# EAGLE design controller_v3 (EAGLE 7.1.0)

## Sheet 1 of 4
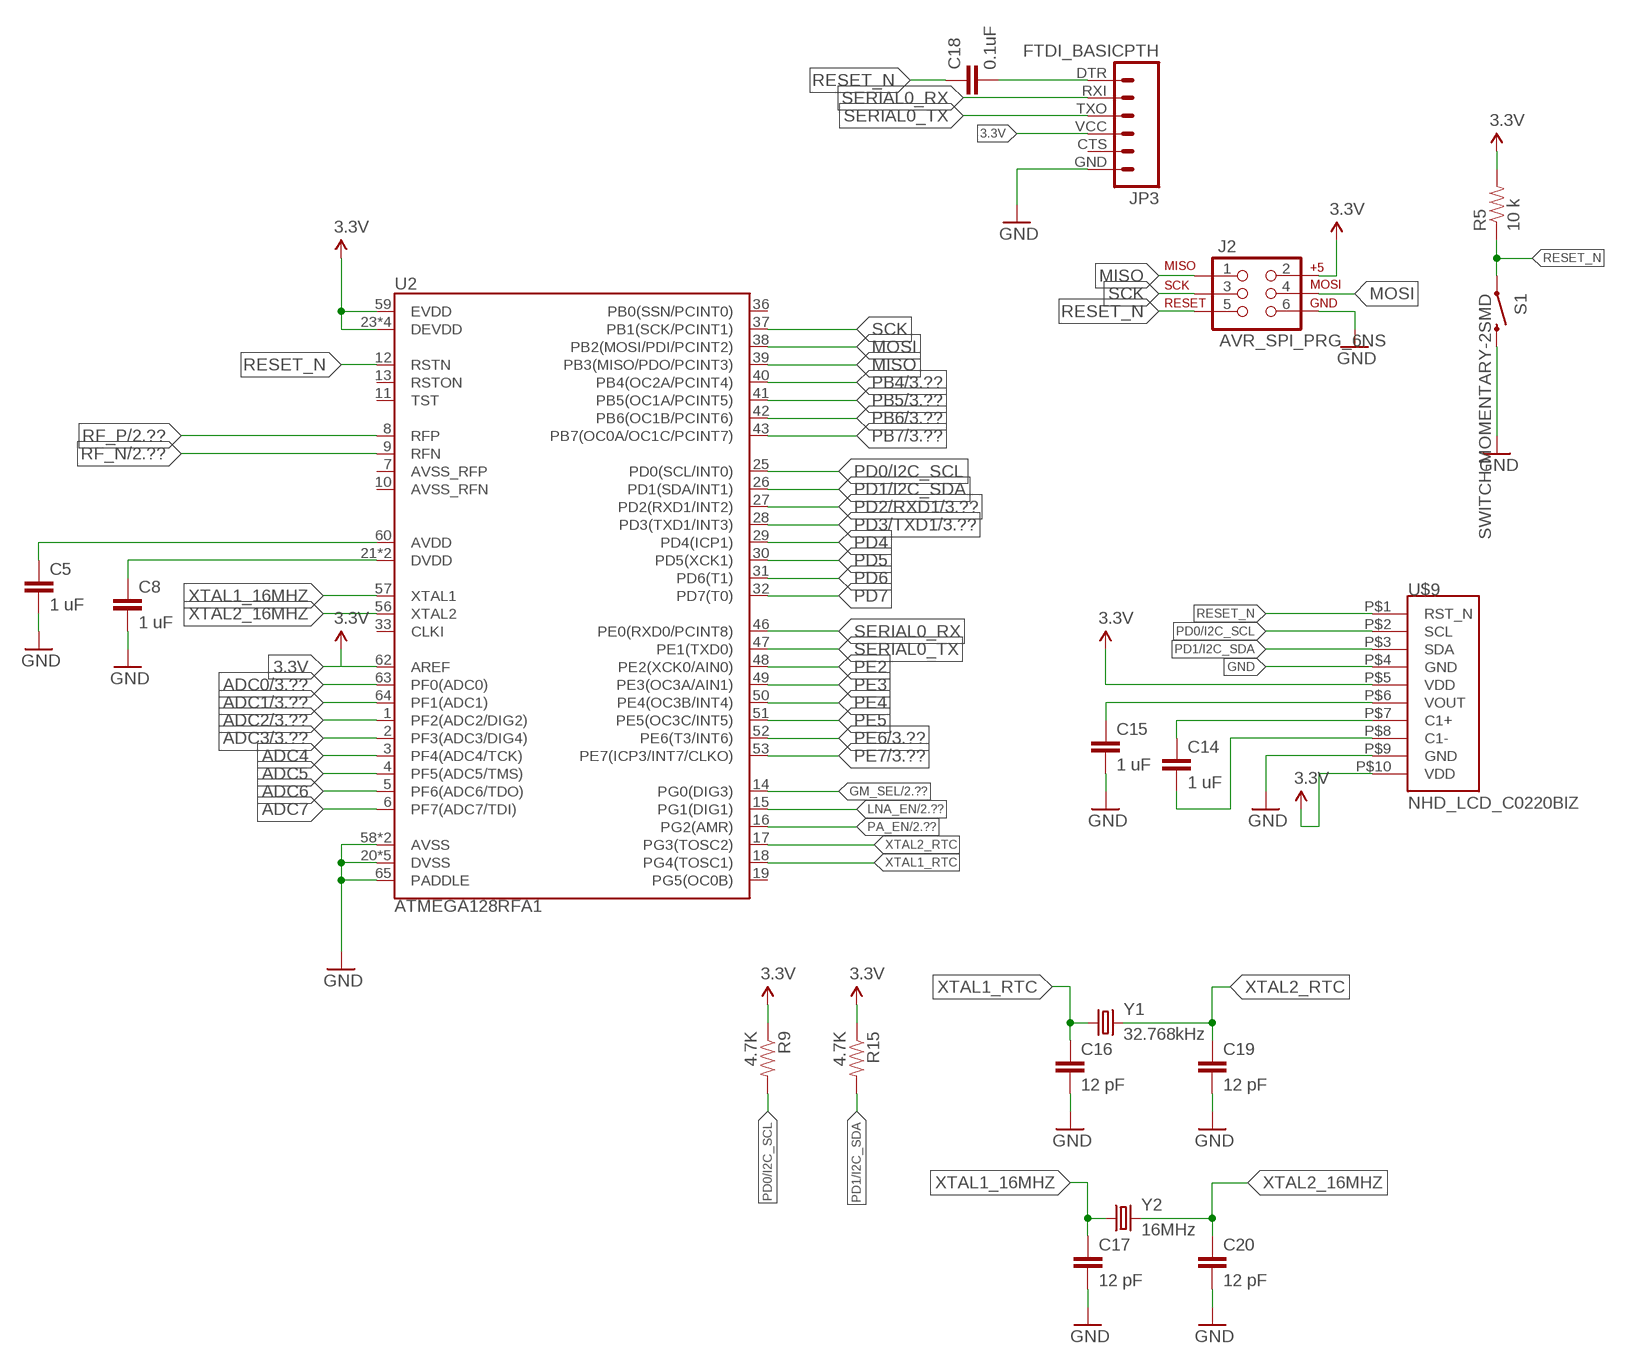
[diagram p0: schematic, sheet 1]

### Parts
C5  1 uF  CAP0805  [0805]
C8  1 uF  CAP0805  [0805]
C14  1 uF  CAP0805  [0805]
C15  1 uF  CAP0805  [0805]
C16  12 pF  CAP0805  [0805]
C17  12 pF  CAP0805  [0805]
C18  0.1uF  CAP0805  [0805]
C19  12 pF  CAP0805  [0805]
C20  12 pF  CAP0805  [0805]
J2  AVR_SPI_PRG_6NS  [2X3-NS]
JP3  FTDI_BASICPTH  [FTDI_BASIC]
R5  10 k  RESISTOR0805-RES  [0805]
R9  4.7K  RESISTOR0805-RES  [0805]
R15  4.7K  RESISTOR0805-RES  [0805]
S1  SWITCH-MOMENTARY-2SMD  [TACTILE_SWITCH_SMD]
U2  ATMEGA128RFA1  [QFN-64]
U$9  NHD_LCD_C0220BIZ  [1X08-2MMPTH-LCD]
Y1  32.768kHz  CRYSTAL32-SMD  [CRYSTAL-32KHZ-SMD]
Y2  16MHz  CRYSTAL5X3  [CRYSTAL-SMD-5X3]

### Nets
3.3V: J2.2 JP3.VCC R5.2 R9.1 R15.1 U2.23(DEVDD) U2.34(DEVDD) U2.44(DEVDD) U2.54(DEVDD) U2.59(EVDD) U2.62(AREF) U$9.P$5(VDD) U$9.P$10(VDD) ; also sheet 2,3,4
ADC0: U2.63(PF0(ADC0)) ; also sheet 3
ADC1: U2.64(PF1(ADC1)) ; also sheet 3
ADC2: U2.1(PF2(ADC2/DIG2)) ; also sheet 3
ADC3: U2.2(PF3(ADC3/DIG4)) ; also sheet 3
ADC4: U2.3(PF4(ADC4/TCK))
ADC5: U2.4(PF5(ADC5/TMS))
ADC6: U2.5(PF6(ADC6/TDO))
ADC7: U2.6(PF7(ADC7/TDI))
GM_SEL: U2.14(PG0(DIG3)) ; also sheet 2
GND: C5.2 C8.2 C15.2 C16.2 C17.2 C19.2 C20.2 J2.6 JP3.GND S1.3 U2.20(DVSS) U2.24(DVSS) U2.35(DVSS) U2.45(DVSS) U2.55(DVSS) U2.58(AVSS) U2.61(AVSS) U2.65(PADDLE) U$9.P$4(GND) U$9.P$9(GND) ; also sheet 2,3,4
LNA_EN: U2.15(PG1(DIG1)) ; also sheet 2
MISO: J2.1 U2.39(PB3(MISO/PDO/PCINT3))
MOSI: J2.4 U2.38(PB2(MOSI/PDI/PCINT2))
N$2: C18.2 JP3.DTR
N$5: C14.1 U$9.P$7(C1+)
N$15: C5.1 U2.60(AVDD)
N$16: C8.1 U2.21(DVDD) U2.22(DVDD)
N$22: C14.2 U$9.P$8(C1-)
PA_EN: U2.16(PG2(AMR)) ; also sheet 2
PB4: U2.40(PB4(OC2A/PCINT4)) ; also sheet 3
PB5: U2.41(PB5(OC1A/PCINT5)) ; also sheet 3
PB6: U2.42(PB6(OC1B/PCINT6)) ; also sheet 3
PB7: U2.43(PB7(OC0A/OC1C/PCINT7)) ; also sheet 3
PD0/I2C_SCL: R9.2 U2.25(PD0(SCL/INT0)) U$9.P$2(SCL)
PD1/I2C_SDA: R15.2 U2.26(PD1(SDA/INT1)) U$9.P$3(SDA)
PD2/RXD1: U2.27(PD2(RXD1/INT2)) ; also sheet 3
PD3/TXD1: U2.28(PD3(TXD1/INT3)) ; also sheet 3
PD4: U2.29(PD4(ICP1))
PD5: U2.30(PD5(XCK1))
PD6: U2.31(PD6(T1))
PD7: U2.32(PD7(T0))
PE2: U2.48(PE2(XCK0/AIN0))
PE3: U2.49(PE3(OC3A/AIN1))
PE4: U2.50(PE4(OC3B/INT4))
PE5: U2.51(PE5(OC3C/INT5))
PE6: U2.52(PE6(T3/INT6)) ; also sheet 3
PE7: U2.53(PE7(ICP3/INT7/CLKO)) ; also sheet 3
RESET_N: C18.1 J2.5 R5.1 S1.1 U2.12(RSTN) U$9.P$1(RST_N)
RF_N: U2.9(RFN) ; also sheet 2
RF_P: U2.8(RFP) ; also sheet 2
SCK: J2.3 U2.37(PB1(SCK/PCINT1))
SERIAL0_RX: JP3.RXI U2.46(PE0(RXD0/PCINT8))
SERIAL0_TX: JP3.TXO U2.47(PE1(TXD0))
VOUT: C15.1 U$9.P$6(VOUT)
XTAL1_16MHZ: C17.1 U2.57(XTAL1) Y2.1
XTAL1_RTC: C16.1 U2.18(PG4(TOSC1)) Y1.X1
XTAL2_16MHZ: C20.1 U2.56(XTAL2) Y2.3
XTAL2_RTC: C19.1 U2.17(PG3(TOSC2)) Y1.X2
Unconnected: JP3.CTS U2.7(AVSS_RFP) U2.10(AVSS_RFN) U2.11(TST) U2.13(RSTON) U2.19(PG5(OC0B)) U2.33(CLKI) U2.36(PB0(SSN/PCINT0))

## Sheet 2 of 4
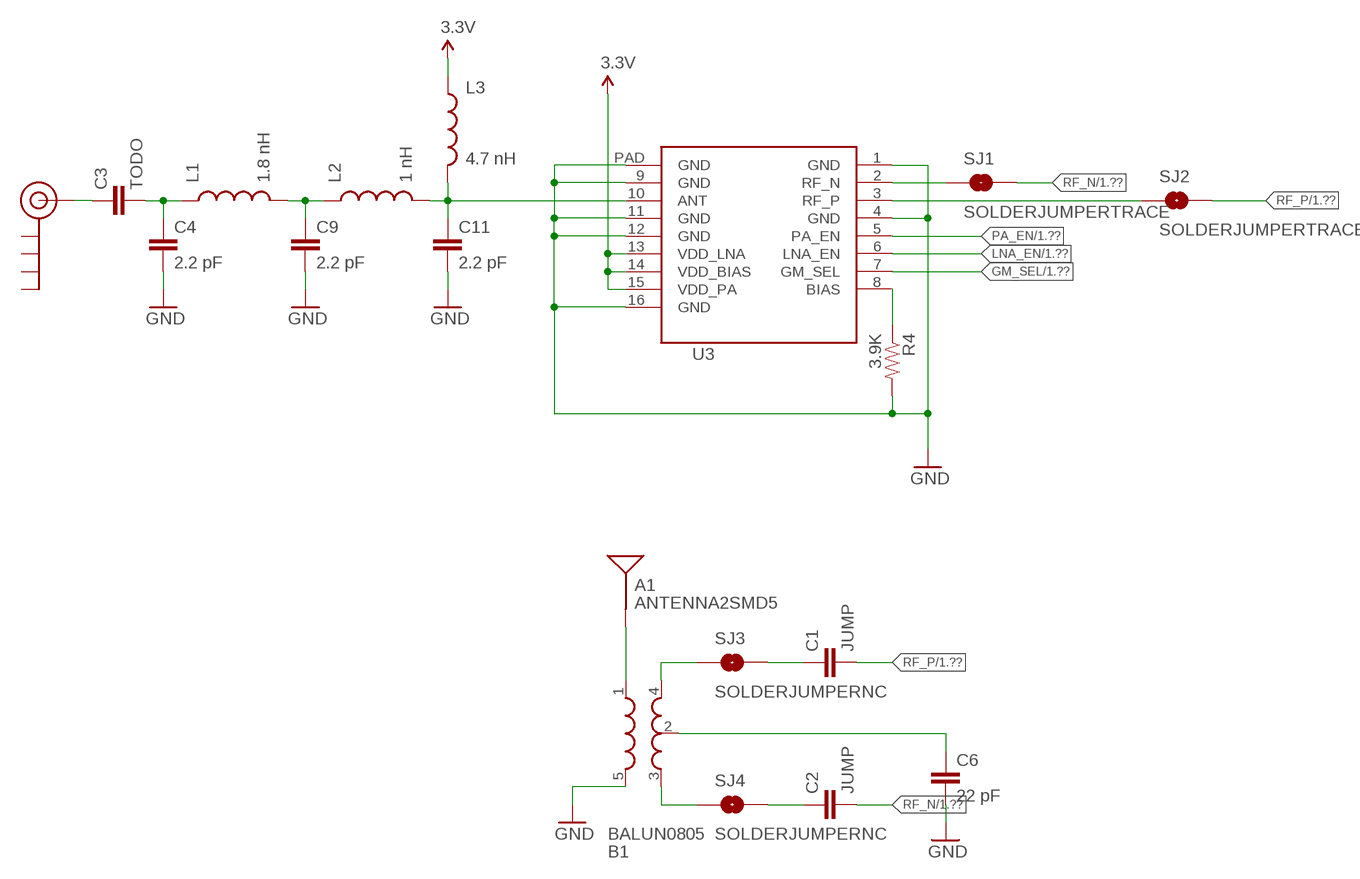
[diagram p1: schematic, sheet 2]

### Parts
A1  ANTENNA2SMD5  [ANTENNA-CHIP5]
B1  BALUN0805  [BALUN]
C1  JUMP  CAP0805  [0805]
C2  JUMP  CAP0805  [0805]
C3  TODO  CAP0805  [0805]
C4  2.2 pF  CAP0805  [0805]
C6  22 pF  CAP0805  [0805]
C9  2.2 pF  CAP0805  [0805]
C11  2.2 pF  CAP0805  [0805]
J$1  SMA_EDGE  [SMA-EDGE]
L1  1.8 nH  INDUCTOR0805  [0805]
L2  1 nH  INDUCTOR0805  [0805]
L3  4.7 nH  INDUCTOR0805  [0805]
R4  3.9K  RESISTOR0805-RES  [0805]
SJ1  SOLDERJUMPERTRACE  [SJ_2S-TRACE]
SJ2  SOLDERJUMPERTRACE  [SJ_2S-TRACE]
SJ3  SOLDERJUMPERNC  [SJ_2S]
SJ4  SOLDERJUMPERNC  [SJ_2S]
U3  RF_AMPLIFIER  CC2592QF  [QFN65P400X400X100-17N]

### Nets
3.3V: L3.1 U3.13(VDD_LNA) U3.14(VDD_BIAS) U3.15(VDD_PA) ; also sheet 1,3,4
GM_SEL: U3.7(GM_SEL) ; also sheet 1
GND: B1.5(GND) C4.2 C6.2 C9.2 C11.2 R4.2 U3.1(GND) U3.4(GND) U3.9(GND) U3.11(GND) U3.12(GND) U3.16(GND) U3.PAD(GND) ; also sheet 1,3,4
LNA_EN: U3.6(LNA_EN) ; also sheet 1
N$1: C9.1 L1.2 L2.1
N$3: C11.1 L2.2 L3.2 U3.10(ANT)
N$4: C3.2 C4.1 L1.1
N$6: SJ1.1 U3.2(RF_N)
N$7: R4.1 U3.8(BIAS)
N$8: C3.1 J$1.SIG(SIGNAL)
N$9: B1.4(OUT1) SJ3.1
N$10: B1.3(OUT2) SJ4.1
N$11: B1.2(GND) C6.1
N$12: A1.FEED(SIGNAL) B1.1(IN)
N$13: C2.1 SJ4.2
N$14: C1.1 SJ3.2
N$17: SJ2.1 U3.3(RF_P)
PA_EN: U3.5(PA_EN) ; also sheet 1
RF_N: C2.2 SJ1.2 ; also sheet 1
RF_P: C1.2 SJ2.2 ; also sheet 1
Unconnected: J$1.GND@0(GND) J$1.GND@1(GND) J$1.GND@2(GND) J$1.GND@3(GND)

## Sheet 3 of 4
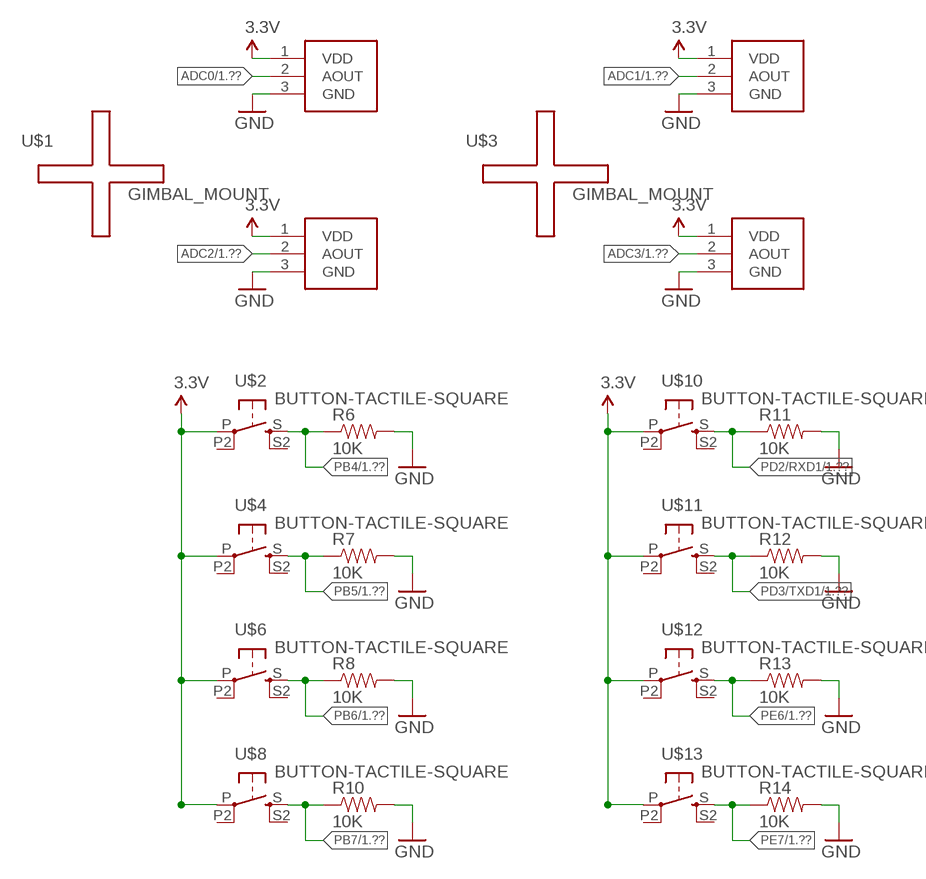
[diagram p2: schematic, sheet 3]

### Parts
J3  GIMBAL_3PIN  [JST-3-PTH]
J4  GIMBAL_3PIN  [JST-3-PTH]
J5  GIMBAL_3PIN  [JST-3-PTH]
J6  GIMBAL_3PIN  [JST-3-PTH]
R6  10K  RESISTOR0805-RES  [0805]
R7  10K  RESISTOR0805-RES  [0805]
R8  10K  RESISTOR0805-RES  [0805]
R10  10K  RESISTOR0805-RES  [0805]
R11  10K  RESISTOR0805-RES  [0805]
R12  10K  RESISTOR0805-RES  [0805]
R13  10K  RESISTOR0805-RES  [0805]
R14  10K  RESISTOR0805-RES  [0805]
U$1  GIMBAL_MOUNT  [GIMBAL_FOOTPRINT]
U$2  BUTTON-TACTILE-SQUARE  [BUTTON-TACTILE-SQUARE-ADAFRUIT1010]
U$3  GIMBAL_MOUNT  [GIMBAL_FOOTPRINT]
U$4  BUTTON-TACTILE-SQUARE  [BUTTON-TACTILE-SQUARE-ADAFRUIT1010]
U$6  BUTTON-TACTILE-SQUARE  [BUTTON-TACTILE-SQUARE-ADAFRUIT1010]
U$8  BUTTON-TACTILE-SQUARE  [BUTTON-TACTILE-SQUARE-ADAFRUIT1010]
U$10  BUTTON-TACTILE-SQUARE  [BUTTON-TACTILE-SQUARE-ADAFRUIT1010]
U$11  BUTTON-TACTILE-SQUARE  [BUTTON-TACTILE-SQUARE-ADAFRUIT1010]
U$12  BUTTON-TACTILE-SQUARE  [BUTTON-TACTILE-SQUARE-ADAFRUIT1010]
U$13  BUTTON-TACTILE-SQUARE  [BUTTON-TACTILE-SQUARE-ADAFRUIT1010]

### Nets
3.3V: J3.1(VDD) J4.1(VDD) J5.1(VDD) J6.1(VDD) U$2.P U$4.P U$6.P U$8.P U$10.P U$11.P U$12.P U$13.P ; also sheet 1,2,4
ADC0: J6.2(AOUT) ; also sheet 1
ADC1: J3.2(AOUT) ; also sheet 1
ADC2: J5.2(AOUT) ; also sheet 1
ADC3: J4.2(AOUT) ; also sheet 1
GND: J3.3(GND) J4.3(GND) J5.3(GND) J6.3(GND) R6.2 R7.2 R8.2 R10.2 R11.2 R12.2 R13.2 R14.2 ; also sheet 1,2,4
PB4: R6.1 U$2.S ; also sheet 1
PB5: R7.1 U$4.S ; also sheet 1
PB6: R8.1 U$6.S ; also sheet 1
PB7: R10.1 U$8.S ; also sheet 1
PD2/RXD1: R11.1 U$10.S ; also sheet 1
PD3/TXD1: R12.1 U$11.S ; also sheet 1
PE6: R13.1 U$12.S ; also sheet 1
PE7: R14.1 U$13.S ; also sheet 1
Unconnected: U$2.P2(P1) U$2.S2(S1) U$4.P2(P1) U$4.S2(S1) U$6.P2(P1) U$6.S2(S1) U$8.P2(P1) U$8.S2(S1) U$10.P2(P1) U$10.S2(S1) U$11.P2(P1) U$11.S2(S1) U$12.P2(P1) U$12.S2(S1) U$13.P2(P1) U$13.S2(S1)

## Sheet 4 of 4
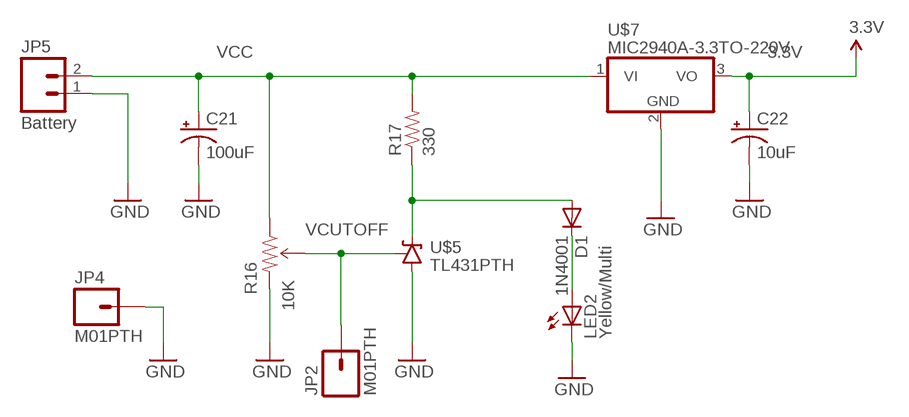
[diagram p3: schematic, sheet 4]

### Parts
C21  100uF  CPOL-USE3.5-8  [E3,5-8]
C22  10uF  CPOL-USE2.5-5  [E2,5-5]
D1  1N4001  1N4004  [DO41-10]
JP2  M01PTH  [1X01]
JP4  M01PTH  [1X01]
JP5  Battery  M02PTH  [1X02]
LED2  Yellow/Multi  LED5MM  [LED5MM]
R16  10K  TRIMPOT-PTH-KNOB  [3386U]
R17  330  RESISTORAXIAL-0.3  [AXIAL-0.3]
U$5  TL431PTH  [TO-92]
U$7  MIC2940A-3.3TO-220V  [TO-220V]

### Nets
3.3V: C22.+ U$7.3(VO) ; also sheet 1,2,3
GND: C21.- C22.- JP4.1 JP5.1 LED2.K(C) R16.3(CW) U$5.2(A) U$7.2(GND) ; also sheet 1,2,3
N$20: D1.A R17.P$1 U$5.3(C)
N$21: D1.C LED2.A
VCC: C21.+ JP5.2 R16.1(CCW) R17.P$2 U$7.1(VI)
VCUTOFF: JP2.1 R16.2(WIPER) U$5.1(R)

## Library data of the parts
A1 = Controller:ANTENNA2: Chip antenna Single endded antenna. Common with smaller chip antennas. CHIP4 package is the GPS Chip Antenna SKU: GPS-08418. CHIP5 package is 2.4GHz chip antenna SKU: WRL-00144.
B1 = Controller:BALUN: 0805 footprint balun- Ember 351/357
C1-C6 C8 C9 C11 C14-C20 = Controller:CAP: Capacitor Standard 0603 ceramic capacitor, and 0.1" leaded capacitor.
C21 C22 = rcl:CPOL-US: POLARIZED CAPACITOR, American symbol
D1 = diode:1N4004: DIODE general purpose rectifier, 1 A
J2 = Controller:AVR_SPI_PRG_6: AVR ISP 6 Pin This is the reduced ISP connector for AVR programming. Common on Arduino. This footprint will take up less PCB space and can be used with a 10-pin to 6-pin adapter such as SKU: BOB-08508
J3-J6 = Controller:GIMBAL_3PIN: This is the surface mount connector for the 9XR Replacement Gimbal. It uses a 3 Pin, 2 mm Pitch, JST connector (https://www.sparkfun.com/products/9750) You can see the analog transmitter here: http://www.hobbyking.com/hobbyking/store/__39505__Transmitter_Gimbal_Set_Left_Turnigy_9XR_Transmitter_Mode_1.html The black wire is VDD, the White wire is Ground, the Red wire is Analog Out Author: Dustin Richmond Created: 10/25/2014
J$1 = Controller:SMA_EDGE: SMA Antenna Connector End launch SMA connector. The paste layer has been removed so that the connector can be hand soldered onto the board after reflow.
JP2 JP4 = SparkFun:M01: Header 1 Standard 1-pin 0.1" header. Use with straight break away headers (SKU : PRT-00116), right angle break away headers (PRT-00553), swiss pins (PRT-00743), machine pins (PRT-00117), and female headers (PRT-00115).
JP3 = Controller:FTDI_BASIC: FTDI Basic header with labels
JP5 = SparkFun:M02: Header 2 Standard 2-pin 0.1" header. Use with straight break away headers (SKU : PRT-00116), right angle break away headers (PRT-00553), swiss pins (PRT-00743), machine pins (PRT-00117), and female headers (PRT-00115). Molex polarized connector foot print use with SKU : PRT-08233 with associated crimp pins and housings.
L1-L3 = Controller:INDUCTOR: Inductors Basic Inductor/Choke - 0603 and 1206. Footprints are not proven and vary greatly between part numbers. SRN6045- 33uH, 20% 1.4A SDR0403-560KL - 56uH, 10%, 500mA RMS/740mA peak
LED2 = SparkFun:LED: LEDs Standard schematic elements and footprints for 5mm, 3mm, 1206, and 0603 sized LEDs. 5mm - Spark Fun Electronics SKU : COM-00529 (and others)
R4-R15 = Controller:RESISTOR: Resistor Basic schematic elements and footprints for 0603, 1206, and PTH resistors.
R16 = SparkFun:TRIMPOT
R17 = SparkFun:RESISTOR: Resistor Basic schematic elements and footprints for 0603, 1206, and PTH resistors.
S1 = Controller:SWITCH-MOMENTARY-2: Various NO switches- pushbuttons, reed, etc
SJ1-SJ4 = Controller:SOLDERJUMPER: Solder Jumper Standard SMD solder jumper. Used to automate production. Two varients : Normally Open and Normally Closed are the same, but have different paste layers. NC will have a large amount of paste and should jumper during reflow.
U2 = Controller:ATMEGA128RFA1: ATmega128RFA1 8-bit AVR Microcontroller with Low Power 2.4GHz Transceiver for ZigBee and IEEE 802.15.4
U3 = Controller:CC2592: Device Symbol for the CC2592 QFN16 RF Amplifier Chip from Texas Instruments. Description: The CC2592 device is a cost-effective and high-performance RF front end for low-power and low-voltage 2.4-GHz wireless applications.The CC2592 device is a range extender for all CC25XX 2.4-GHz low-power RF transceivers, transmitters, and system-on-chip products from Texas Instruments.To increase the link budget, the CC2592 device provides a power amplifier for increased output power and an LNA with a low-noise figure for improved receiver sensitivity.The CC2592 device provides a very small size, high-output power RF design with its 4-mm × 4-mm QFN-16 package.The CC2592 device contains PA, LNA, switches, RF-matching, and balun for simple design of high-performance wireless applications Datasheet: http://www.ti.com/general/docs/lit/getliterature.tsp?genericPartNumber=cc2592&fileType=pdf Note: I have NOT added the thermal pads expected in the datasheet. These should be added by the end user on their PCB Author: Dustin Richmond Date Created: 10/16/2014 Reviewer 1: Reviewer 2:
U$1 U$3 = Controller:GIMBAL_MOUNT
U$2 U$4 U$6 U$8 U$10-U$13 = Controller:BUTTON-TACTILE
U$5 = SparkFun:TL431
U$7 = SparkFun:MIC2940A-3.3: MIC2940A-3.3 Voltage Regulator 3.3V mic2940.pdf
U$9 = Controller:NHD_LCD_C0220BIZ: This is the device for the NHD‐C0220BiZ‐FSW‐FBW‐3V3M COG (Chip‐On‐Glass) Character Liquid Crystal Display Module. Datasheet: http://www.newhavendisplay.com/specs/NHD-C0220BiZ-FSW-FBW-3V3M.pdf Author: Dustin Richmond Created: 10/25/2014
Y1 Y2 = Controller:CRYSTAL: Various standard crystals. Proven footprints. Spark Fun Electronics SKU : COM-00534

## Board
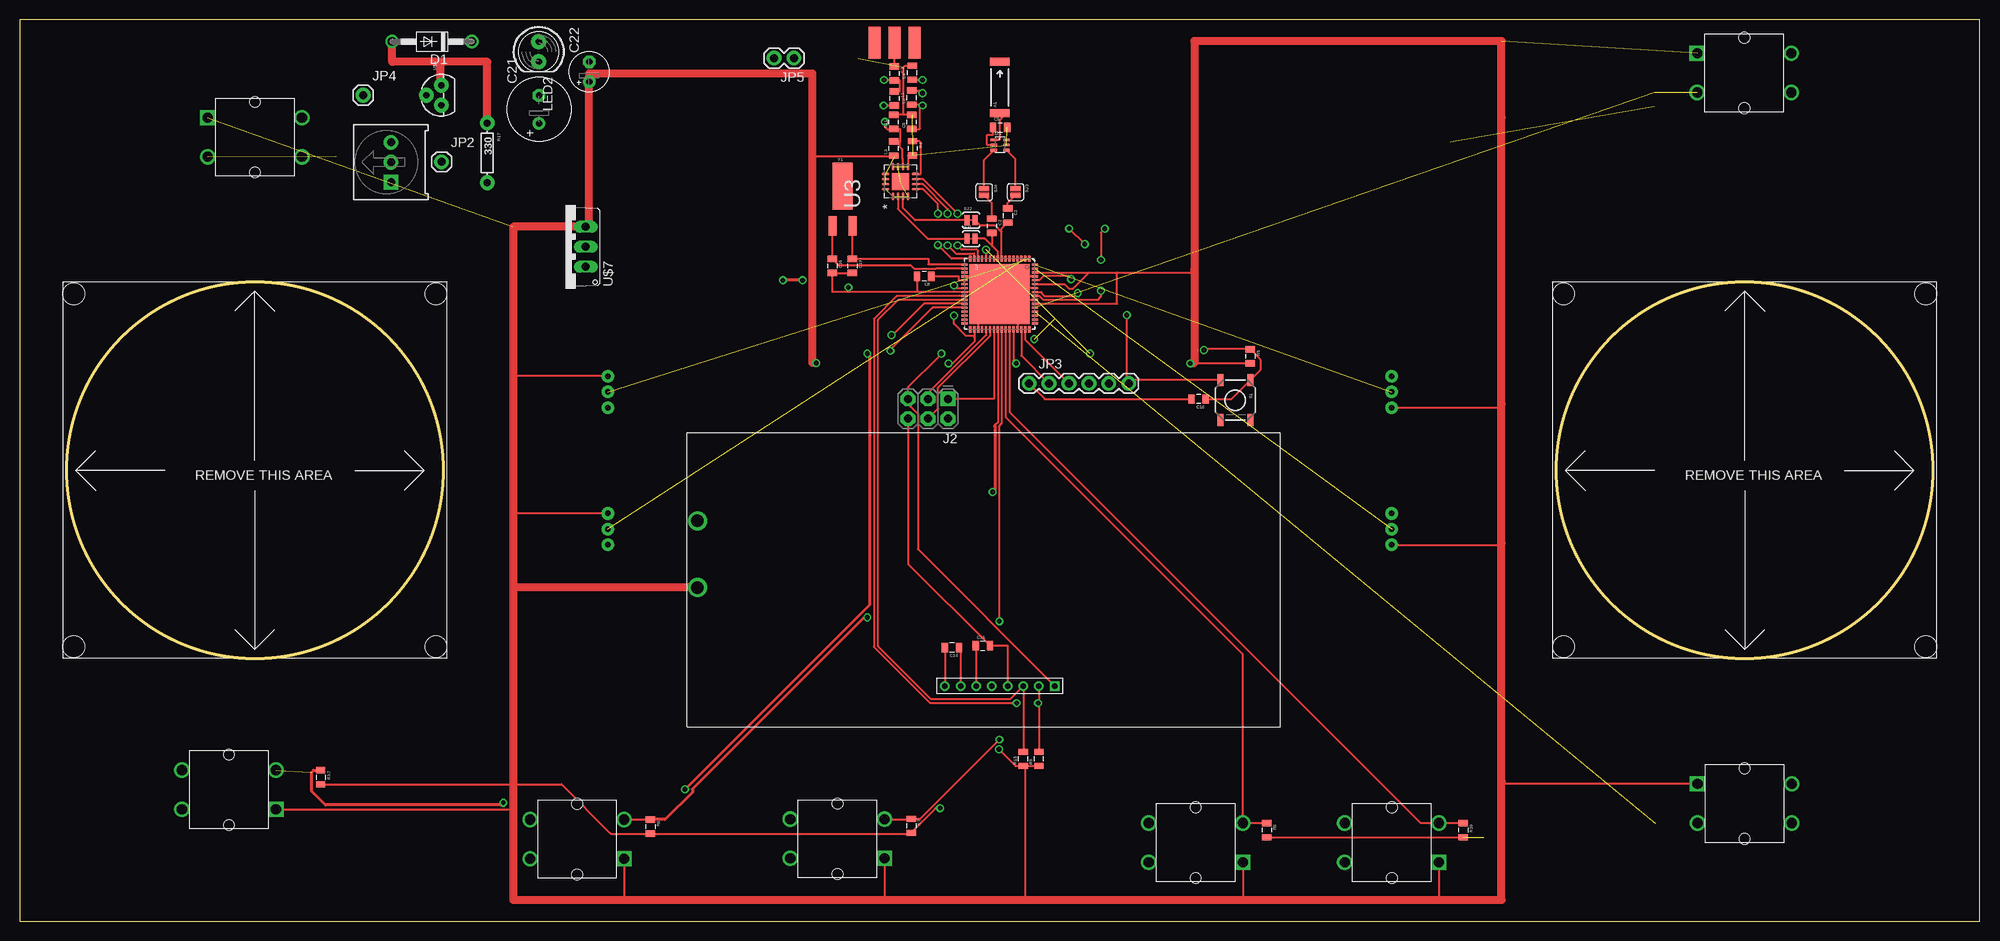
[diagram p4: board, top side]
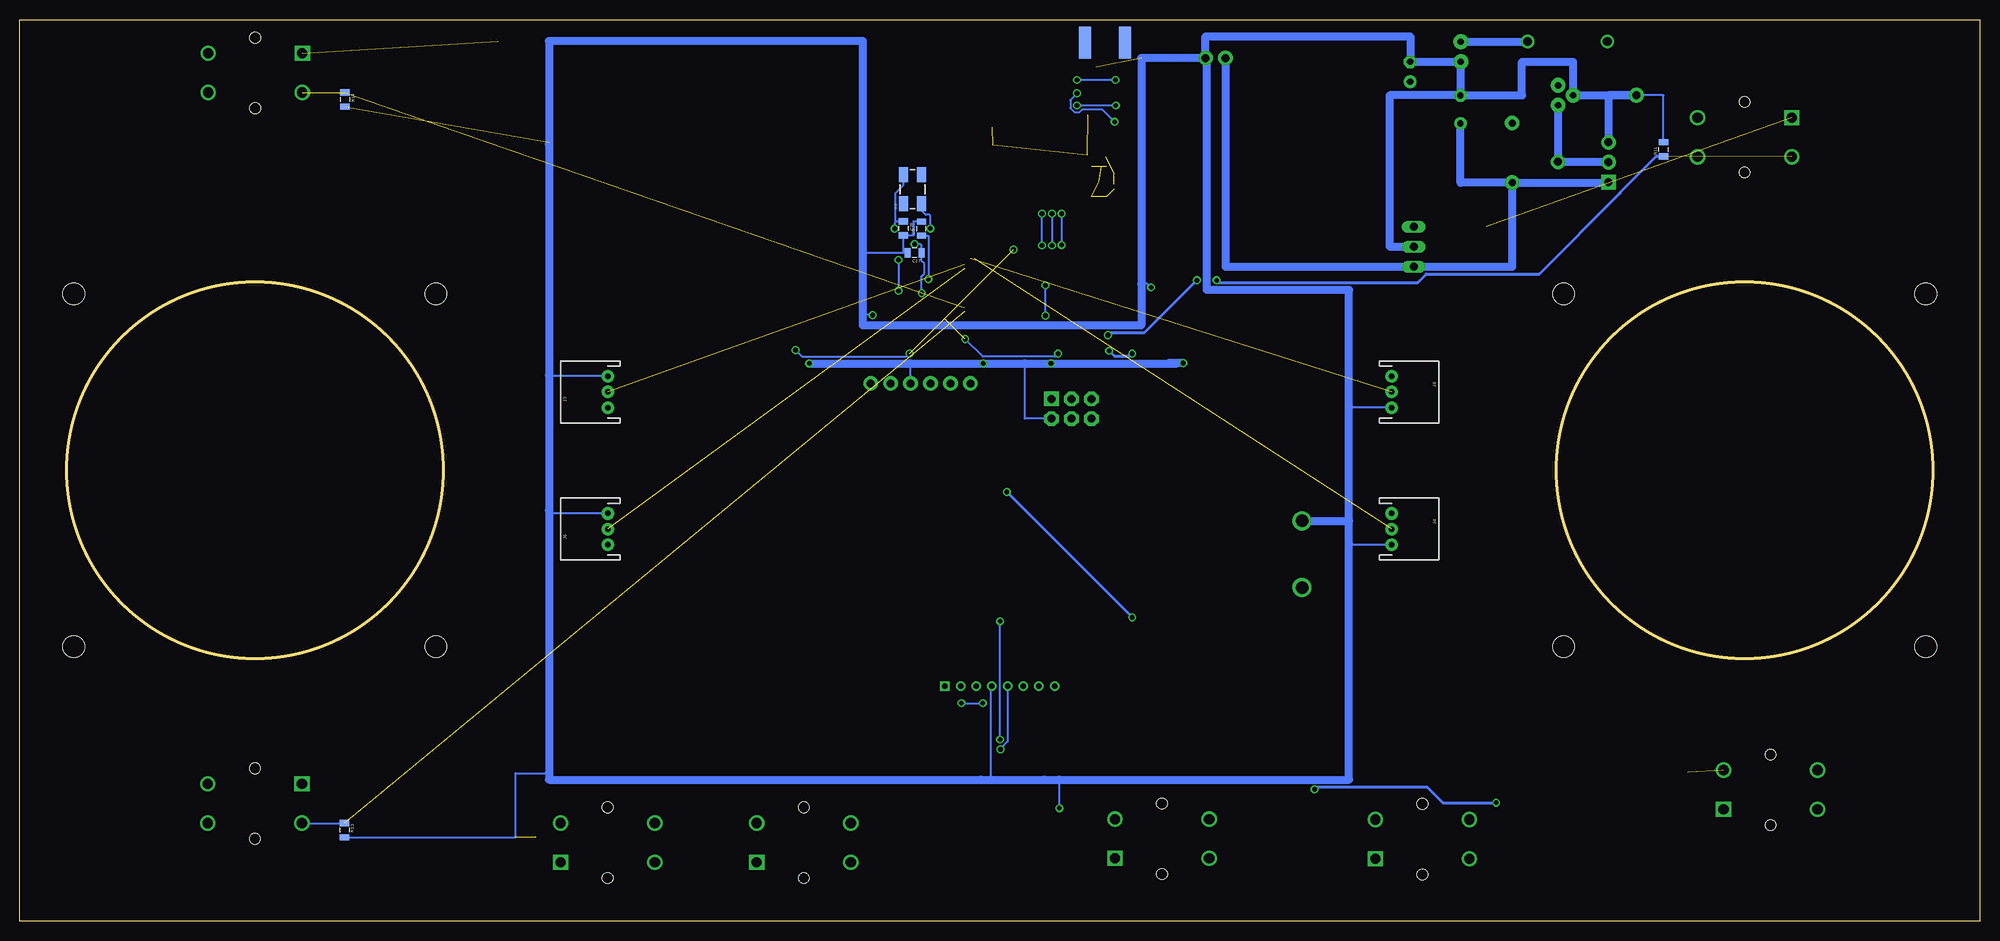
[diagram p5: board, bottom side, seen from below]

Size 250 x 115 mm. Coordinates in mm from the lower left corner, seen from the top.
Outline: 0,0 250,0 250,115 0,115 0,0
Copper layers (1*16): Top 0.035mm / dielectric 1.5mm / Bottom 0.035mm
Design rules "default": minimum track width 10mil, minimum drill 24mil, track to track 8mil, track to pad 8mil, pad to pad 8mil, via to via 8mil, smd to smd 8mil, copper to edge 40mil, drill to drill 8mil, minimum pad ring 10mil, minimum via ring 8mil, stop-mask expansion 4mil, vias tented up to drill 0mil, thermal gap 10mil

### Footprints (pad centres in the part's own frame; a part is rotated, then mirrored left to right if it is on the bottom)
ANTENNA-CHIP5 = smd 1.016 x 2.54: FEED -3.302,0; NC 3.302,0
BALUN = smd 0.35 x 0.8: 1 -0.65,-0.8; 2 0,-0.8; 3 0.65,-0.8; 4 0.65,0.8; 5 0,0.8; 6 -0.65,0.8
0805 = smd 0.8 x 1.2: 1 -0.9,0; 2 0.9,0
E3,5-8 = drill 0.813 pad 1.6: + -1.778,0 | drill 0.813 pad 1.6 octagon: - 1.778,0
E2,5-5 = drill 0.813 pad 1.6: + -1.27,0 | drill 0.813 pad 1.6 octagon: - 1.27,0
DO41-10 = drill 1.118: A 5.08,0; C -5.08,0
2X3-NS = drill 1.016 pad 1.88 square: 1 -2.54,-1.27 | drill 1.016 pad 1.88 octagon: 2 -2.54,1.27; 3 0,-1.27; 4 0,1.27; 5 2.54,-1.27; 6 2.54,1.27
JST-3-PTH = drill 0.7 pad 1.6: 1 -2,0; 2 0,0; 3 2,0
SMA-EDGE = smd 1.524 x 4.064: GND@0 0,0; GND@1 5.08,0; SIG 2.54,0 | smd 1.524 x 4.064 bottom: GND@2 0,0; GND@3 5.08,0
1X01 = drill 1.016 pad 1.88: 1 0,0
FTDI_BASIC = drill 1.016 pad 1.88: CTS 10.16,0; DTR 0,0; GND 12.7,0; RXI 2.54,0; TXO 5.08,0; VCC 7.62,0
1X02 = drill 1.016 pad 1.88: 1 0,0; 2 2.54,0
LED5MM = drill 0.813 pad 1.88: A -1.27,0; K 1.27,0
3386U = drill 1.016 pad 1.88 square: 1 -2.54,-0.015 | drill 1.016 pad 1.88: 2 0,-0.015; 3 2.54,-0.015
AXIAL-0.3 = drill 0.9 pad 1.88: P$1 -3.81,0; P$2 3.81,0
TACTILE_SWITCH_SMD = smd 1.524 x 0.762: 1 -2.54,1.905; 2 2.54,1.905; 3 -2.54,-1.905; 4 2.54,-1.905
SJ_2S-TRACE = smd 0.635 x 1.27: 1 -0.508,0; 2 0.508,0
SJ_2S = smd 0.635 x 1.27: 1 -0.412,0; 2 0.412,0
QFN-64 = smd 0.8 x 0.28: 1 -4.5,3.75; 2 -4.5,3.25; 3 -4.5,2.75; 4 -4.5,2.25; 5 -4.5,1.75; 6 -4.5,1.25; 7 -4.5,0.75; 8 -4.5,0.25; 9 -4.5,-0.25; 10 -4.5,-0.75; 11 -4.5,-1.25; 12 -4.5,-1.75; 13 -4.5,-2.25; 14 -4.5,-2.75; 15 -4.5,-3.25; 16 -4.5,-3.75; 33 4.5,-3.75; 34 4.5,-3.25; 35 4.5,-2.75; 36 4.5,-2.25; 37 4.5,-1.75; 38 4.5,-1.25; 39 4.5,-0.75; 40 4.5,-0.25; 41 4.5,0.25; 42 4.5,0.75; 43 4.5,1.25; 44 4.5,1.75; 45 4.5,2.25; 46 4.5,2.75; 47 4.5,3.25; 48 4.5,3.75 | smd 0.28 x 0.8: 17 -3.75,-4.5; 18 -3.25,-4.5; 19 -2.75,-4.5; 20 -2.25,-4.5; 21 -1.75,-4.5; 22 -1.25,-4.5; 23 -0.75,-4.5; 24 -0.25,-4.5; 25 0.25,-4.5; 26 0.75,-4.5; 27 1.25,-4.5; 28 1.75,-4.5; 29 2.25,-4.5; 30 2.75,-4.5; 31 3.25,-4.5; 32 3.75,-4.5; 49 3.75,4.5; 50 3.25,4.5; 51 2.75,4.5; 52 2.25,4.5; 53 1.75,4.5; 54 1.25,4.5; 55 0.75,4.5; 56 0.25,4.5; 57 -0.25,4.5; 58 -0.75,4.5; 59 -1.25,4.5; 60 -1.75,4.5; 61 -2.25,4.5; 62 -2.75,4.5; 63 -3.25,4.5; 64 -3.75,4.5 | smd 7.65 x 7.65: 65 0,0
QFN65P400X400X100-17N = smd 1 x 0.35: 1 -1.9,0.975; 2 -1.9,0.325; 3 -1.9,-0.325; 4 -1.9,-0.975; 9 1.9,-0.975; 10 1.9,-0.325; 11 1.9,0.325; 12 1.9,0.975 | smd 0.35 x 1: 5 -0.975,-1.9; 6 -0.325,-1.9; 7 0.325,-1.9; 8 0.975,-1.9; 13 0.975,1.9; 14 0.325,1.9; 15 -0.325,1.9; 16 -0.975,1.9 | smd 2.16 x 2.16: PAD 0,0
GIMBAL_FOOTPRINT = hole 2.8: -23.1,22.5; -23.1,-22.5; 23.1,-22.5; 23.1,22.5
BUTTON-TACTILE-SQUARE-ADAFRUIT1010 = drill 1.3 square: P -6,2.5 | drill 1.3: P2 6,2.5; S -6,-2.5; S2 6,-2.5 | hole 1.4: 0,4.5; 0,-4.5
TO-92 = drill 0.813 pad 1.88: 1 -1.27,0; 2 0,1.905; 3 1.27,0
TO-220V = drill 1.016 long: 1 -1.27,0; 2 1.27,0; 3 3.81,0
1X08-2MMPTH-LCD = drill 0.7 square: P$1 7,0 | drill 0.7: P$2 5,0; P$3 3,0; P$4 1,0; P$5 -1,0; P$6 -3,0; P$7 -5,0; P$8 -7,0 | drill 1.6: P$9 -38.55,21.05; P$10 -38.55,12.55
CRYSTAL-32KHZ-SMD = smd 2.5 x 6: SHEILD 0,5.08 | smd 1 x 2.5: X1 -1.27,0; X2 1.27,0
CRYSTAL-SMD-5X3 = smd 1.9 x 1.1: 1 -1.85,-1.15; 2 1.85,-1.15; 3 1.85,1.15; 4 -1.85,1.15

### Placement (x,y rotation side)
A1  125,106.35 90 top
B1  125.05,99 270 top
C1  126,90 270 top
C2  124,88.7 270 top
C3  111.57,108.13 270 top
C4  113.82,108.22 90 top
C5  134.98,88.33 90 bottom
C6  125.05,101.25 0 top
C8  115.36,82.27 180 top
C9  113.8,101.95 90 top
C11  111.5,101.95 90 top
C14  118.9,34.9 180 top
C15  122.85,35.15 0 top
C16  103.65,83.59 270 top
C17  135.87,85.23 180 bottom
C18  150.36,66.59 180 top
C19  106.2,83.59 270 top
C20  137.28,88.37 270 bottom
C21  66.25,103.55 90 top
C22  72.65,108.35 90 top
D1  52.6,112.2 180 top
J2  115.85,65.35 180 top
J3  175,67.5 90 bottom
J4  75,50 270 bottom
J5  75,67.5 270 bottom
J6  175,50 90 bottom
J$1  109.03,112.04 0 top
JP2  53.8,96.85 0 top
JP3  128.75,68.6 0 top
JP4  43.8,105.35 0 top
JP5  98.75,110.1 180 top
L1  111.55,104.95 270 top
L2  113.8,105.05 90 top
L3  111.5,98.55 90 top
LED2  66.2,110.9 270 top
R4  113.88,98.58 270 top
R5  156.95,72.05 270 top
R6  80.45,12.05 270 top
R7  113.7,12.15 270 top
R8  159.05,11.6 270 top
R9  130,20.7 90 top
R10  184.1,11.6 270 top
R11  40.35,98.45 90 bottom
R12  38.4,18.35 270 top
R13  208.6,11.6 270 bottom
R14  208.5,104.8 270 bottom
R15  128,20.7 90 top
R16  47.35,96.8 90 top
R17  59.65,98 270 top
S1  155.04,66.45 270 top
SJ1  121.35,87.05 0 top
SJ2  121.35,89.4 0 top
SJ3  127,93 270 top
SJ4  123,93 270 top
U2  125,80 270 top
U3  112.34,94.34 90 top
U$1  30,57.5 0 top
U$2  71.1,10.45 180 top
U$3  220,57.5 0 top
U$4  104.3,10.5 180 top
U$5  53.8,105.35 90 top
U$6  150,10 180 top
U$7  72.2,84.75 90 top
U$8  175,10 180 top
U$9  125,30 0 top
U$10  30,100 0 top
U$11  26.7,16.75 180 top
U$12  220,15 0 top
U$13  219.95,108.2 0 top
Y1  104.95,88.69 0 top
Y2  136.13,93.36 90 bottom

### Tracks (layer width: path | path; a pad name or v marks a point on that pad's centre or on a via)
3.3V  (via drill 0.6 pad 0.41, 0.61 pad 1.02)  (5 unrouted)
  Top 0.254: J3.1 189,65.5 189,65.9 | J6.1 189,48 189,48.2 | 189,102.5 189,102.55 | U$12.P 189,17.5 189,17.8 | L3.1 111.5,97.5 101.1,97.5 | 124.38,2.7 124.45,2.7 | U2.62 136.4,82.75 | 136.4,82.75 139.95,82.75 | 139.95,82.75 149.8,82.75 149.8,83.05 | U2.54 139.95,78.75 139.95,82.75 | 101.1,80.75 101.1,80.65 | U2.44 126.75,71.55 127.15,71.15 v127.1,71.15 | U$6.P 156,3.15 156.45,2.7 | U$4.P 110.3,3.15 109.85,2.7 | J4.1 62.95,52 62.95,51.8 | J5.1 62.95,69.5 62.95,69.4 | U$8.P 181,2.8 181.1,2.7 | U$2.P 77.1,3.2 77.6,2.7 | U$11.P 62.5,14.25 62.95,13.8 | R5.2 149.85,71.15 149.8,71.2 | v118.45,71.15 119,71.15 121.8,73.95 121.8,74.45 121.75,74.5 121.75,74.65 | U2.34 121.75,74.65 | U2.23 119.5,80.75 v119.15,81.1 | v119.15,77.25 119.15,76.2 120.7,74.65 121.75,74.65 | U2.59 133.25,81.25 133.8,80.7 134.35,80.7 136.4,82.75 | R15.1 R9.1 | R15.1 128.25,19.55 128.25,2.7 | R15.1 127,19.8 v124.9,21.9
  Top 1.016: C22.+ 72.65,108.1 101.1,108.1 101.1,97.5 101.1,80.65 101.1,71.2 v101.6,71.2 | 72.6,107.2 72.6,88.56 U$7.3 62.95,88.56 62.95,69.4 62.95,51.8 62.95,42.55 | v149.3,71.15 149.8,71.2 149.8,83.05 149.8,112.25 189,112.25 189,102.55 189,65.9 189,48.2 189,17.8 189,2.7 181.1,2.7 156.45,2.7 128.25,2.7 124.45,2.7 109.85,2.7 77.6,2.7 62.95,2.7 62.95,13.8 62.95,42.55 | U$9.P$10 62.95,42.55
  Bottom 0.254: J2.2 121.8,64.08 121.8,71.15 | JP3.VCC 136.37,71.12 136.4,71.15 | v119.15,77.25 v119.15,81.1 | v124.9,21.9 124.9,22 124,22.9 U$9.P$5
  Bottom 1.016: v101.6,71.2 102.4,71.2 | 102.4,71.2 103.4,71.2 | v149.3,71.15 136.4,71.15 v127.1,71.15 121.8,71.15 v118.45,71.15 102.4,71.15 102.4,71.2
ADC0  (1 unrouted)
ADC1  (1 unrouted)
ADC2  (1 unrouted)
ADC3  (1 unrouted)
GM_SEL  (via drill 0.61 pad 1.02)
  Top 0.254: v119.6,90.25 115.2,94.65 114.25,94.65 U3.7 | v119.6,86.2 120.15,85.65 122.1,85.65 122.25,85.5 U2.14
  Bottom 0.254: v119.6,86.2 v119.6,90.25
GND  (via drill 0.6 pad 0.41, 0.61 pad 1.02)  (12 unrouted)
  Top 0.254: C9.2 112.75,102.85 | 112.75,102.85 C11.2 | 112.75,102.85 112.75,108.9 112.95,109.1 113.8,109.1 C4.2 | U3.9 113.3,97.7 113.85,97.7 R4.2 | U$9.P$4 126,35.15 C15.2 113.31,45.59 J2.6 | 127.75,80 U2.65 | 127.75,80 128.5,80.75 U2.58 | 122.75,80.25 123.75,80.25 124,80 U2.65 | 122.75,80.25 U2.24 114.45,80.25 | U2.35 122.25,80.15 U2.65 | U2.61 128.95,82.25 128.45,81.75 128.45,80.85 U2.65 | U2.55 127.75,79.25 | 127.75,79.25 127.75,80 | 127.75,79.25 127.25,79.25 U2.45 | U2.20 122.75,82.25 122.75,80.25 | 114.45,80.25 105.7,80.25 | 105.7,80.25 103.65,80.25 C16.2 C19.2 | C8.2 114.45,81.26 114.45,80.25 | v141.2,77.3 141.2,68.85 JP3.GND 141.84,68.99 S1.3 | R8.2 R10.2 | R12.2 69.1,17.45 75.4,11.15 R6.2 113.6,11.15 R7.2 116.9,14.45 117,14.4 v117.4,14.4 | 105.7,80.25 v105.7,80.85
  Bottom 0.254: J4.3 80.45,48 80.45,48.1 | J5.3 80.45,65.5 80.45,65.55 | J3.3 182.5,69.5 182.5,69.65 | J6.3 182.5,52 182.5,52.4 | 182.5,99.35 182.5,99.1 | R13.2 186.75,10.7 186.75,18.85 182.5,18.85 | R11.2 40.35,105.35 JP4.1 | 127.06,18.05 127.4,18.05 | 116.9,18.05 117.4,18.05 v117.4,14.4 | 142.65,77.6 142.65,77.7 142.45,76 | C5.2 136,89.23 136,87.47 C20.2 137.25,87.45 137.35,87.45 137.35,85.23 | 141.35,77.3 v141.2,77.3 141.45,77.35 142.45,77.35 | C17.2 137.35,85.23 | 137.35,85.23 142.45,85.23 142.45,84.75 | U$9.P$4 126.15,29.85 126.15,18.05 | v105.7,80.85 106.1,81.25 106.2,81.3 106.95,81.3
  Bottom 1.016: 80.45,51.05 80.45,48.1 80.45,18.05 117.4,18.05 119.3,18.05 126.15,18.05 127.4,18.05 182.5,18.05 182.5,18.85 182.5,52.4 182.5,69.65 182.5,99.1 182.5,112.25 142.45,112.25 142.45,84.75 142.45,77.35 142.45,76 106.95,76 106.95,81.3 106.95,110.1 JP5.1 98.75,112.85 72.65,112.85 C22.- LED2.K 66.25,109.63 C21.- | 80.45,51.05 80.45,65.55 80.45,80.5 98.6,80.5 98.6,110.45 | U$9.P$9 80.45,51.05 | C21.- 75.3,105.33 75.3,86.05 72.2,86.05 U$7.2 | C21.- 58.4,105.33 58.4,109.6 51.9,109.6 U$5.2 JP4.1 47.37,105.35 R16.3
LNA_EN  (via drill 0.61 pad 1.02)
  Top 0.254: U2.15 121.75,85.15 119.4,85.15 v118.35,86.2 | v118.35,90.25 118.35,90.85 115.2,94 114.25,94 U3.6
  Bottom 0.254: v118.35,90.25 v118.35,86.2
MISO
  Top 0.254: U2.39 124.25,66.62 J2.1
MOSI
  Top 0.254: J2.4 117.15,65.38 117.15,68.05 123.75,74.65 U2.38
N$1  (via drill 0.61 pad 1.02)
  Top 0.254: L2.1 114.7,104.15 114.85,104 | 114.85,104 114.85,101.1 114.8,101.05 C9.1 | v110.2,104.05 L1.2 | v115.15,104.05 114.95,104.05 114.85,104
  Bottom 0.254: v115.15,104.05 v110.2,104.05
N$2
  Top 0.254: JP3.DTR 130.76,66.59 C18.2
N$3  (via drill 0.61 pad 1.02)
  Top 0.254: v110.35,101.95 110.35,101.3 110.6,101.05 C11.1 112.25,101.05 112.25,99.45 | v115.15,105.6 114.8,105.95 L2.2 | 112.25,99.45 L3.2 | 112.25,99.45 112.3,99.35 112.3,98.7 112.6,98.4 112.6,97.25 112.65,97.2 112.65,96.25 U3.10
  Bottom 0.254: v110.35,101.95 111.95,103.55 114.45,103.55 114.8,103.2 115.5,103.2 116,103.7 116,104.75 v115.15,105.6
N$4  (via drill 0.61 pad 1.02)
  Top 0.254: L1.1 112.25,105.85 112.25,107.25 111.6,107.25 C3.2 111.45,107.25 110.6,107.25 110.55,107.3 v110.25,107.3 | v115.15,107.3 113.85,107.3 C4.1
  Bottom 0.254: v110.25,107.3 v115.15,107.3
N$5
  Top 0.254: C14.1 120,34.9 U$9.P$7
N$6
  Top 0.254: U3.2 112.02,90.83 115.8,87.05 SJ1.1
N$7
  Top 0.254: R4.1 113.9,99.5 114.75,99.5 114.95,99.3 114.95,95.35 114.9,95.3 U3.8
N$8
  Top 0.254: J$1.SIG 111.55,112 111.55,109.1 111.5,109.05 111.55,109 C3.1
N$9
  Top 0.254: SJ3.1 127,97.2 B1.4
N$10
  Top 0.254: SJ4.1 123,97.1 B1.3
N$11
  Top 0.254: C6.1 124.15,100.35 124.1,100.3 123.45,100.3 123.4,100.25 123.4,99.05 123.45,99 B1.2
N$12
  Top 0.254: B1.1 124.95,99.65 125,99.7 125,102.15 125.5,102.65 125.5,103.05 A1.FEED
N$13
  Top 0.254: C2.1 124,91.59 SJ4.2
N$14
  Top 0.254: C1.1 126,91.59 SJ3.2
N$15  (via drill 0.6 pad 0.41)
  Top 0.254: U2.60 130.05,81.75 130.55,82.25 133.75,82.25 v134.1,81.9
  Bottom 0.254: v134.1,81.9 134.1,87.4 134.15,87.45 134.95,87.45 C5.1
N$16
  Top 0.254: U2.22 U2.21 119.75,81.75 119.75,82.27 C8.1
N$17
  Top 0.254: U3.3 112.65,92.42 112.65,90.95 114.2,89.4 SJ2.1
N$20
  Top 1.016: R17.P$1 59.65,109.6 53.7,109.6 | 53.7,109.6 47.52,109.6 D1.A | U$5.3 53.7,106.62 53.7,109.6
N$21
  Bottom 1.016: LED2.A 57.68,112.17 D1.C
N$22
  Top 0.254: C14.2 U$9.P$8
PA_EN  (via drill 0.61 pad 1.02)
  Top 0.254: v117.1,90.25 117.1,91.45 115.2,93.35 114.25,93.35 U3.5 | U2.16 118.85,84.5 v117.1,86.25
  Bottom 0.254: v117.1,90.25 v117.1,86.25
PB4  (via drill 0.6 pad 0.41)
  Top 0.254: U$2.S R6.1 | U2.40 124.75,63.6 124.35,63.2
  Top 0.406: R6.1 82.3,12.95 85.8,16.45 85.8,16.85 107.7,38.75 v108.1,38.75 | v124.1,54.75 124.4,55.05 124.4,63.1 124.35,63.2
  Bottom 0.406: v124.1,54.75 v108.1,38.75
PB5  (via drill 0.6 pad 0.41)
  Top 0.254: U$4.S 113.65,13 R7.1 114.7,13.05 114.75,13 114.8,13 v124.95,23.15 | U2.41 125.25,63.45 124.95,63.15 v124.95,38.25
  Bottom 0.254: v124.95,23.15 v124.95,38.25
PB6
  Top 0.254: U2.42 125.75,64.3 156,34.05 U$6.S R8.1
PB7
  Top 0.254: U2.43 126.25,64.95 178.7,12.5 U$8.S R10.1
PD0/I2C_SCL  (via drill 0.6 pad 0.41)
  Top 0.254: U2.25 120.45,79.7 111.85,79.7 108.95,76.8 108.95,35 116.15,27.8 v127.15,27.8 | U$9.P$2 130,27.8 | 130,27.8 R9.2 | v129.9,27.8 130,27.8
  Bottom 0.254: v129.9,27.8 v127.15,27.8
PD1/I2C_SDA
  Top 0.254: R15.2 U$9.P$3 126.3,28.3 116.25,28.3 109.5,35.05 109.5,76.7 112.05,79.25 U2.26
PD2/RXD1  (via drill 0.6 pad 0.41)  (1 unrouted)
  Top 0.254: U2.27 115.35,78.75 111.28,74.67 111,74.4
  Top 0.406: v99.85,81.75 v97.35,81.75 | v111.2,74.75 111.28,74.67
  Bottom 0.406: R11.1 41.25,97.55 45.9,92.9 45.9,92.85 56.2,82.55 70.6,82.55 71.7,81.45 97.05,81.45 v97.35,81.75 | v99.85,81.75 106.55,75.05 110.9,75.05 v111.2,74.75
PD3/TXD1  (via drill 0.6 pad 0.41)  (1 unrouted)
  Top 0.254: U2.28 116.45,78.25 111.1,72.9
  Top 0.406: R12.1 37.5,19.25 37.25,19 37.25,16.55 39,14.8 61.4,14.8 v61.7,15.1 | v84.85,16.8 108.4,40.35 108.4,72.1 v108.1,72.4 | v111.05,72.75 111.05,72.8 111.1,72.9
  Bottom 0.406: v61.7,15.1 68.5,15.1 70.5,17.1 84.55,17.1 v84.85,16.8 | v108.1,72.4 108.4,72.1 110.4,72.1 v111.05,72.75
PE6  (1 unrouted)
  Bottom 0.254: U$12.S R13.1
PE7  (2 unrouted)
RESET_N  (via drill 0.61 pad 1.02)  (5 unrouted)
  Top 0.254: C18.1 154.54,66.59 S1.1 158.3,70.34 158.3,71.6 R5.1 151.05,72.95 | 151.05,72.95 151,72.95 | v123.25,85.65 U2.12 | v151.05,72.85 151.05,72.95 | v117.55,72.4 117.35,72.2 117.3,72.1 113.31,68.11 J2.5 113.31,65.94 114.55,64.7 114.55,47.45 U$9.P$1
  Bottom 0.254: v136.5,72.4 136.9,72 150.2,72 v151.05,72.85 | v129.4,74.25 127.15,72 117.95,72 v117.55,72.4
RF_N
  Top 0.254: U2.9 124.75,85.4 124.08,86.08 124,86.15 | 124,86.15 123.1,87.05 SJ1.2 | C2.2 124,86.15
RF_P
  Top 0.254: C1.2 125.25,88.35 125.25,87.9 | U2.8 125.25,87.9 | 125.25,87.9 124.45,88.7 122.56,88.7 SJ2.2
SCK
  Top 0.254: U2.37 123.25,74.75 115.85,67.35 J2.3
SERIAL0_RX
  Top 0.254: U2.46 127.75,72.14 JP3.RXI
SERIAL0_TX
  Top 0.254: U2.47 128.25,74.18 JP3.TXO
VCC
  Bottom 1.016: JP5.2 96.21,83.48 U$7.1 59.65,83.48 R17.P$2 | R17.P$2 47.37,94.19 R16.1 | R17.P$2 66.25,94.19 C21.+
VCUTOFF
  Bottom 1.016: U$5.1 JP2.1 47.37,96.85 R16.2
VOUT
  Top 0.254: C15.1 122,35.15 U$9.P$6
XTAL1_16MHZ  (via drill 0.6 pad 0.41)
  Top 0.254: v134.95,80.1 134.6,79.75 130.7,79.75 130.35,80.1 130.35,80.2 130.3,80.25 U2.57 | v135.85,86.35 v133.85,88.35
  Bottom 0.254: v134.95,80.1 134.95,82.25 134.6,82.6 134.6,83.85 134.9,84.15 134.95,84.25 134.95,85.2 C17.1 134.95,85.35 134.95,86.2 135.1,86.35 v135.85,86.35 | v133.85,88.35 133.85,90 133.95,90.1 134.45,90.1 135,90.65 135,91.5 Y2.1
XTAL1_RTC
  Top 0.254: U2.18 117.35,83.25 116.9,83.25 114.05,83.25 113.6,83.7 104.47,83.7 103.68,84.49 | C16.1 103.68,84.49 | 103.68,84.49 Y1.X1
XTAL2_16MHZ  (via drill 0.61 pad 1.02)
  Top 0.254: v137.9,80.4 137.9,79.75 137.85,79.65 137.45,79.25 130.55,79.25 130.05,79.75 U2.56 | v137.9,84.35 137.9,87.85 v138.4,88.35
  Bottom 0.254: 138.25,89.25 138.3,89.3 138.3,92.85 137.3,93.85 137.3,95.2 Y2.3 | 138.25,89.25 137.3,89.25 C20.1 | v137.9,84.35 v137.9,80.4 | v138.4,88.35 138.4,89.05 138.3,89.15 138.25,89.25
XTAL2_RTC
  Top 0.254: U2.17 115.9,83.75 115.9,84.49 C19.1 106.22,84.49 Y1.X2